# Altium schematic sheet AVR USB Downloader V2.SchDoc
size A4
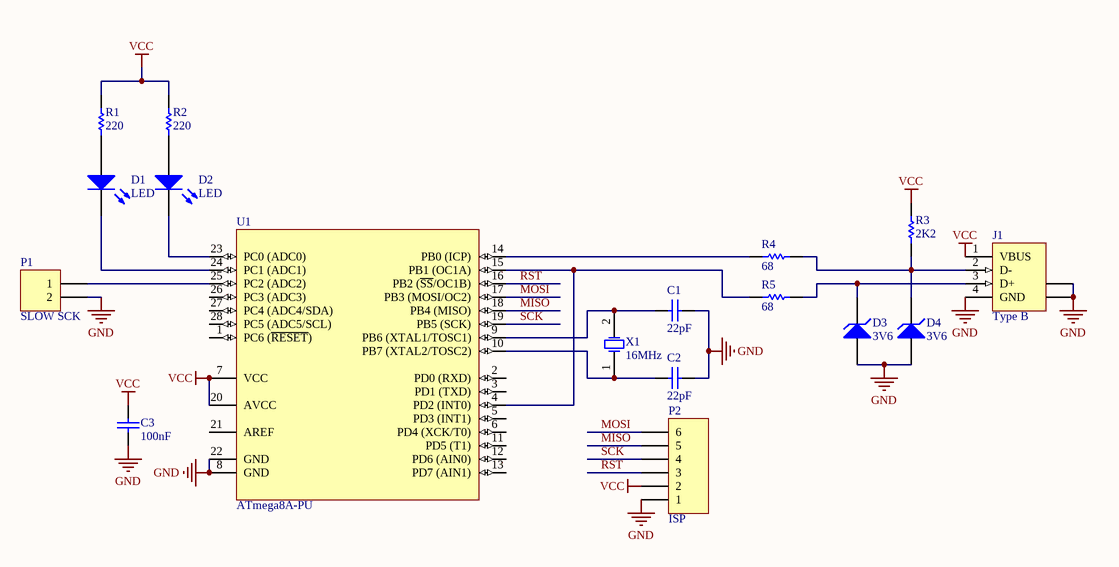
[diagram p0: AVR USB Downloader V2.SchDoc]

## Parts
C1  22pF  [C025-024X044]
C2  22pF  [C025-024X044]
C3  100nF  [C025-024X044]
D1  LED  [LED3MM]
D2  LED  [LED3MM]
D3  3V6  [DO34Z7]
D4  3V6  [DO34Z7]
J1  Type B  [USB-A-H]
P1  SLOW SCK  [HDR1X2]
P2  ISP  [HDR1X6H]
R1  220  [0207/10]
R2  220  [0207/10]
R3  2K2  [0207/10]
R4  68  [0207/10]
R5  68  [0207/10]
U1  ATmega8A-PU  [28P3]
X1  16MHz  [HC49US]

## Nets
GND: C1.1 C2.1 C3.1 D3.1(A) D4.1(A) J1.4(GND) J1.5(SHLD) J1.6(SHLD) P1.2 P2.1 U1.8(GND) U1.22(GND)
VCC: C3.2 J1.1(VBUS) P2.2 R1.2 R2.2 R3.2 U1.7(VCC) U1.20(AVCC)
MISO: P2.5 U1.18(PB4_(MISO))
MOSI: P2.6 U1.17(PB3_(MOSI/OC2))
RST: P2.3 U1.16(PB2_(~{SS}/OC1B))
SCK: P2.4 U1.19(PB5_(SCK))
NetC1_2: C1.2 U1.9(PB6_(XTAL1/TOSC1)) X1.2(OSC2)
NetC2_2: C2.2 U1.10(PB7_(XTAL2/TOSC2)) X1.1(OSC1)
NetD1_1: D1.1(A) R1.1
NetD1_2: D1.2(K) U1.24(PC1_(ADC1))
NetD2_1: D2.1(A) R2.1
NetD2_2: D2.2(K) U1.23(PC0_(ADC0))
NetD3_2: D3.2(K) J1.3(D+) R5.2
NetD4_2: D4.2(K) J1.2(D-) R3.1 R4.2
NetP1_1: P1.1 U1.25(PC2_(ADC2))
NetR4_1: R4.1 U1.14(PB0_(ICP))
NetR5_1: R5.1 U1.4(PD2_(INT0)) U1.15(PB1_(OC1A))

Not connected (* = marked no-connect by the designer): U1 1(PC6_(~{RESET})) 2(PD0_(RXD)) 3(PD1_(TXD)) 5(PD3_(INT1)) 6(PD4_(XCK/T0)) 11(PD5_(T1)) 12(PD6_(AIN0)) 13(PD7_(AIN1)) 21(AREF) 26(PC3_(ADC3)) 27(PC4_(ADC4/SDA)) 28(PC5_(ADC5/SCL))

## Notes on the sheet
- Title
- Size:
- Date:
- A4
- Drawn By:
- Time:
- Sheet
- of
- toko-Embedded
- www.toko-embedded.com
- Hp : 085765221924
- Batam, Kepulauan Riau
- Indonesia
- File:

## Library data of the parts
C1-C3 = Capacitor: Type: Ceramic; Category: Capacitor; Price: *
  C1 C2: Value: 22pF
  C3: Value: 100nF
D1 D2 = LED: Type: 3mm; Value: Red; Category: LED; Price: 200; Link: http://www.sfe-electronics.com/product.php?category=13&product_id=46
D3 D4 = Zener: Value: 3V6; Category: Diode Zener; Type: *; Price: *
J1 = USB: Value: Type B; Category: Connector; Type: USB; Price: 2250; Link: http://www.sfe-electronics.com/product.php?category=12&product_id=156
P1 = Header 2: Header, 2-Pin; LatestRevisionDate: 17-Jul-2002; LatestRevisionNote: Re-released for DXP Platform.; Publisher: Altium Limited
P2 = Header 6H: Header, 6-Pin, Right Angle; LatestRevisionDate: 17-Jul-2002; LatestRevisionNote: Re-released for DXP Platform.; Publisher: Altium Limited
R1-R5 = Resistor: Category: Resistor; Type: 1/4W - 5%; Price: 30; Link: http://www.sfe-electronics.com/product.php?category=6&product_id=79
  R1 R2: Value: 220
  R3: Value: 2K2
  R4 R5: Value: 68
U1 = ATmega8A-PU: 8-bit AVR Microcontroller, 8KB Flash, 512 Bytes EEPROM, 1KB SRAM, 28-pin PDIP, Industrial Grade (-40°C to 85°C); Published: 1-Apr-2010; DatasheetVersion: revC, Jul-2009; PackageVersion: revB, Sep-2001; PackageReference: 28P3; Publisher: Altium Limited; PackageDescription: 28-lead (0.300"/7.62mm Wide) Plastic Dual Inline Package (PDIP); Supplier 1: Digi-Key; Supplier Part Number 1: ATMEGA8A-PU-ND; Supplier 2: Farnell; Supplier Part Number 2: 1748534; Supplier 3: Mouser; Supplier Part Number 3: 556-ATMEGA8A-PU; ComponentLink1Description: Manufacturer Link; ComponentLink1URL: http://www.atmel.com/products/avr/default.asp?; ComponentLink2Description: ATmega8A Datasheet; ComponentLink2URL: http://www.atmel.com/dyn/resources/prod_documents/doc8159.pdf; ComponentLink3Description: ATmega8A Summary; ComponentLink3URL: http://www.atmel.com/dyn/resources/prod_documents/8159S.pdf; ComponentLink4Description: Atmel.com Home; ComponentLink4URL: http://www.atmel.com
X1 = Crystal: Value: 16MHz; Category: Crystal; Type: *; Price: *